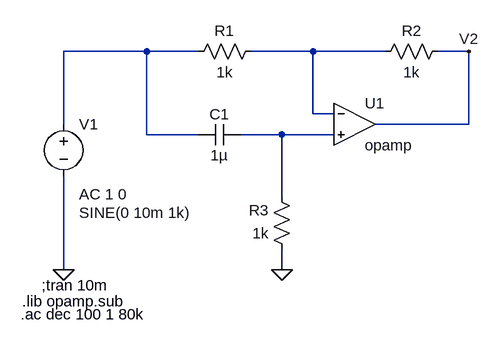
[diagram p0: schematic ts1_tc2.asc]
ts1_tc2.asc, the LTspice schematic file:
Version 4
SHEET 1 880 680
WIRE -80 80 -208 80
WIRE 0 80 -80 80
WIRE 176 80 80 80
WIRE 288 80 176 80
WIRE 416 80 368 80
WIRE 176 176 176 80
WIRE 208 176 176 176
WIRE -208 192 -208 80
WIRE 416 192 416 80
WIRE 416 192 272 192
WIRE -80 208 -80 80
WIRE 0 208 -80 208
WIRE 128 208 64 208
WIRE 208 208 128 208
WIRE 128 304 128 208
WIRE -208 416 -208 272
WIRE 128 416 128 384
FLAG 128 416 0
FLAG -208 416 0
FLAG 416 80 V2
SYMBOL OpAmps\\opamp 240 128 R0
SYMATTR InstName U1
SYMBOL res 96 64 R90
WINDOW 0 0 56 VBottom 2
WINDOW 3 32 56 VTop 2
SYMATTR InstName R1
SYMATTR Value 1k
SYMBOL res 384 64 R90
WINDOW 0 0 56 VBottom 2
WINDOW 3 32 56 VTop 2
SYMATTR InstName R2
SYMATTR Value 1k
SYMBOL res 144 400 R180
WINDOW 0 36 76 Left 2
WINDOW 3 36 40 Left 2
SYMATTR InstName R3
SYMATTR Value 1k
SYMBOL cap 64 192 R90
WINDOW 0 0 32 VBottom 2
WINDOW 3 32 32 VTop 2
SYMATTR InstName C1
SYMATTR Value 1µ
SYMBOL voltage -208 176 R0
WINDOW 3 24 152 Left 2
WINDOW 123 24 124 Left 2
WINDOW 39 0 0 Left 0
SYMATTR InstName V1
SYMATTR Value SINE(0 10m 1k)
SYMATTR Value2 AC 1 0
TEXT -242 440 Left 2 !;tran 10m
TEXT -272 464 Left 2 !.lib opamp.sub
TEXT -274 484 Left 2 !.ac dec 100 1 80k

The netlist it stands for:
* ts1_tc2.asc
XU1 N002 N003 V2 opamp Aol=100K GBW=10Meg  ; pins invin noninvin out
R1 N002 N001 1k
R2 V2 N002 1k
R3 0 N003 1k
C1 N003 N001 1µ
V1 N001 0 SINE(0 10m 1k) AC 1 0
;tran 10m
.lib opamp.sub
.ac dec 100 1 80k
.backanno
.end